# EAGLE design 8.1 (EAGLE 9.2.0)

## Sheet 1 of 6: Microcontroller
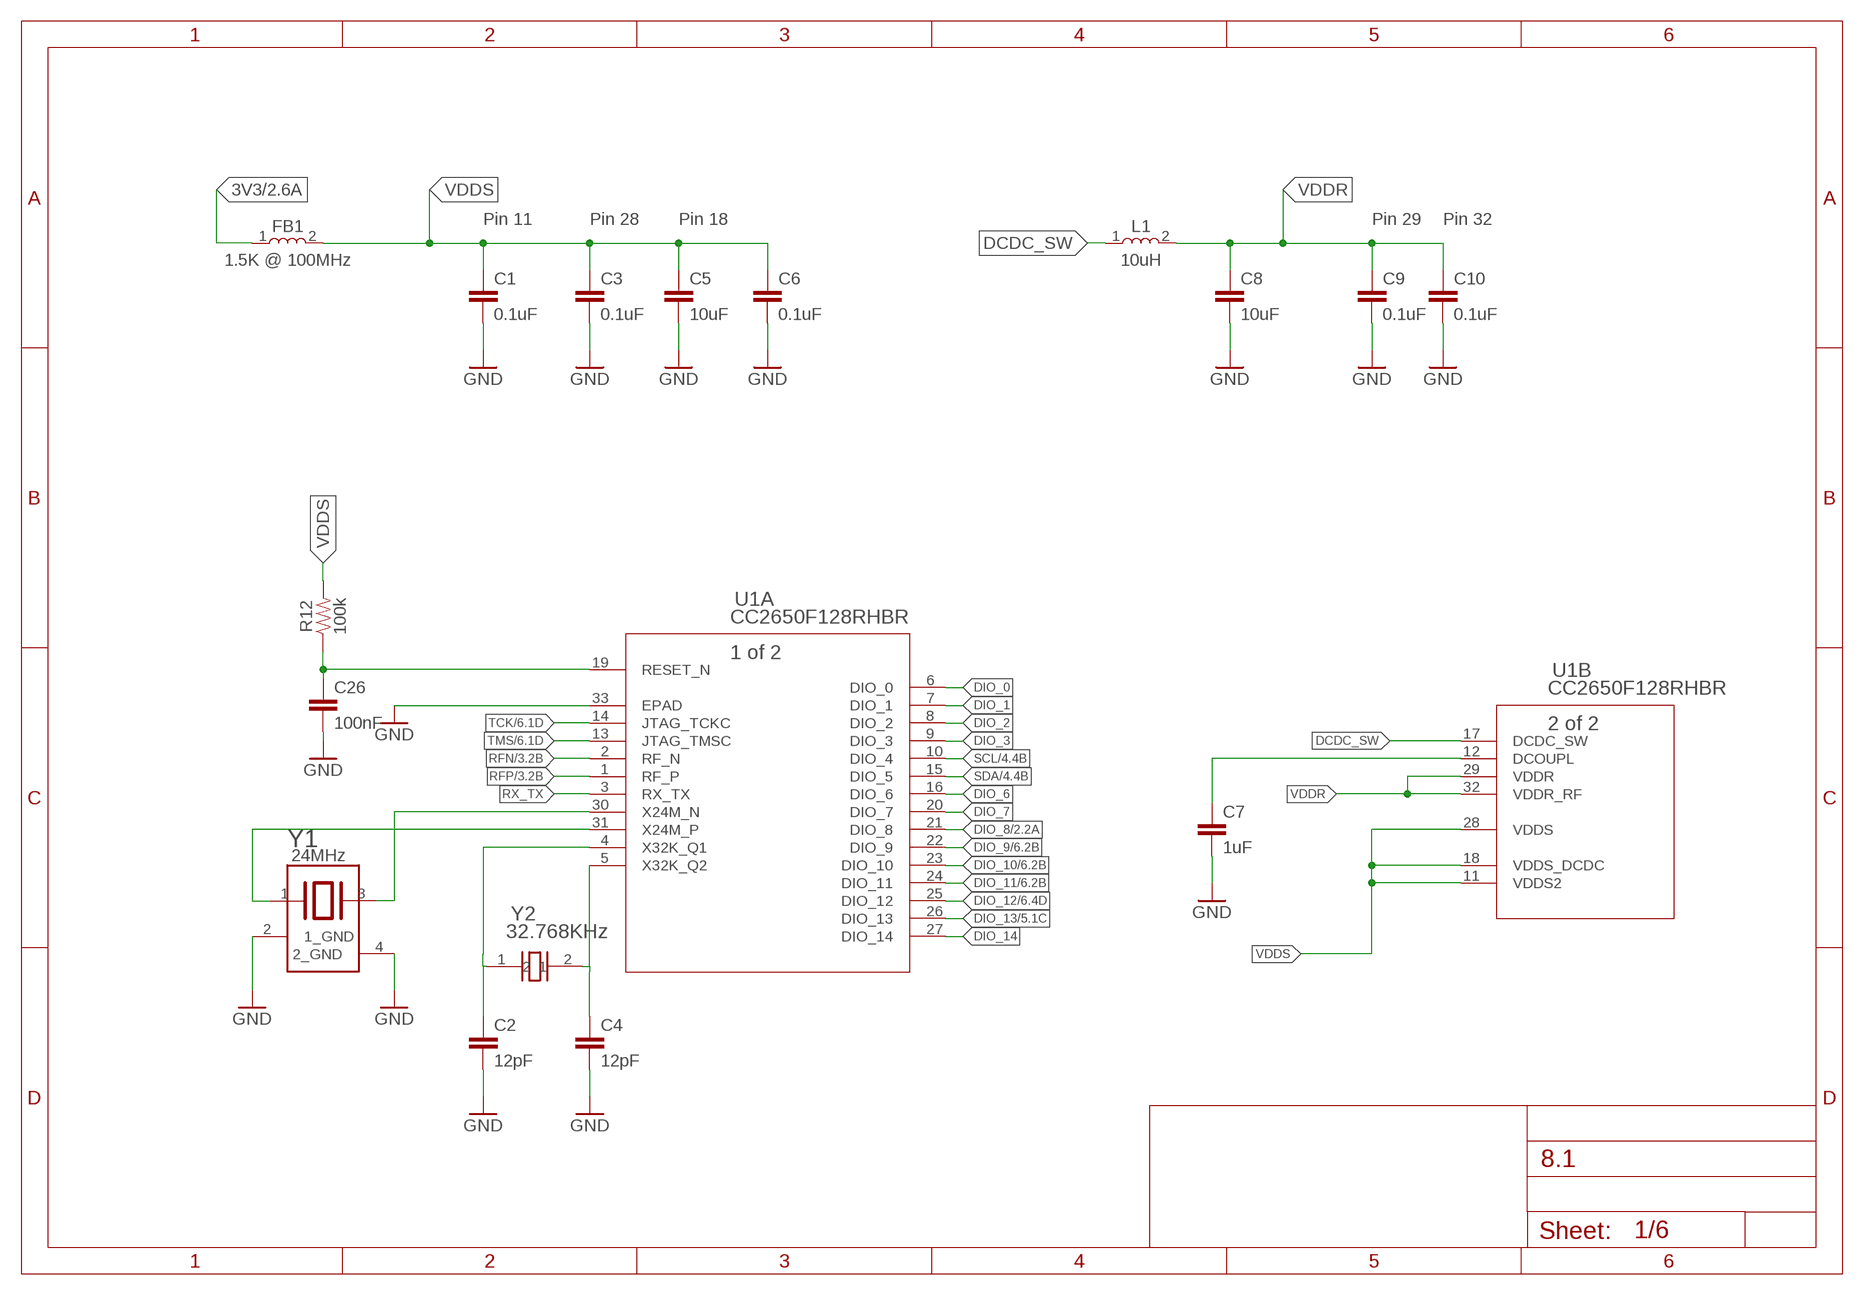
[diagram p0: schematic, sheet 1]

### Parts
C1  0.1uF  C0402  [0402]
C2  12pF  C0402_5%  [0402]
C3  0.1uF  C0402  [0402]
C4  12pF  C0402_5%  [0402]
C5  10uF  C0402  [0402]
C6  0.1uF  C0402  [0402]
C7  1uF  C0402  [0402]
C8  10uF  C0402  [0402]
C9  0.1uF  C0402  [0402]
C10  0.1uF  C0402  [0402]
C26  100nF  C0402_5%  [0402]
FB1  1.5K @ 100MHz  FERRITE_BEAD_CC2650  [0603]
L1  10uH  L0805  [0805]
R12  100k  R0402  [0402]
U1  CC2650F128RHBR  [VFQFN-32]
Y1  24MHz  XTAL_24MHZ_CC2650_HF  [TSX-3225]
Y2  32.768KHz  XTAL_32.768KHZ_CC2650_LF  [FC-135]

### Nets
3V3: FB1.1 ; also sheet 2,4,5,6
DCDC_SW: L1.1 U1.17(B:DCDC_SW)
DIO_0: U1.6(A:DIO_0)
DIO_1: U1.7(A:DIO_1)
DIO_2: U1.8(A:DIO_2)
DIO_3: U1.9(A:DIO_3)
DIO_6: U1.16(A:DIO_6)
DIO_7: U1.20(A:DIO_7)
DIO_8: U1.21(A:DIO_8) ; also sheet 2
DIO_9: U1.22(A:DIO_9) ; also sheet 6
DIO_10: U1.23(A:DIO_10) ; also sheet 6
DIO_11: U1.24(A:DIO_11) ; also sheet 6
DIO_12: U1.25(A:DIO_12) ; also sheet 6
DIO_13: U1.26(A:DIO_13) ; also sheet 5
DIO_14: U1.27(A:DIO_14)
GND: C1.2 C2.2 C3.2 C4.2 C5.2 C6.2 C7.2 C8.2 C9.2 C10.2 C26.2 U1.33(A:EPAD) Y1.2(1_GND) Y1.4(2_GND) ; also sheet 2,3,4,5,6
N$2: C7.1 U1.12(B:DCOUPL)
N$4: U1.30(A:X24M_N) Y1.3
N$5: U1.31(A:X24M_P) Y1.1
N$6: C2.1 U1.4(A:X32K_Q1) Y2.1
N$7: C4.1 U1.5(A:X32K_Q2) Y2.2
N$15: C26.1 R12.1 U1.19(A:RESET_N)
RFN: U1.2(A:RF_N) ; also sheet 3
RFP: U1.1(A:RF_P) ; also sheet 3
RX_TX: U1.3(A:RX_TX)
SCL: U1.10(A:DIO_4) ; also sheet 4,6
SDA: U1.15(A:DIO_5) ; also sheet 4,6
TCK: U1.14(A:JTAG_TCKC) ; also sheet 6
TMS: U1.13(A:JTAG_TMSC) ; also sheet 6
VDDR: C8.1 C9.1 C10.1 L1.2 U1.29(B:VDDR) U1.32(B:VDDR_RF)
VDDS: C1.1 C3.1 C5.1 C6.1 FB1.2 R12.2 U1.11(B:VDDS2) U1.18(B:VDDS_DCDC) U1.28(B:VDDS)

### Notes on the sheet
- Pin 11 | Pin 28 | Pin 18 | Pin 29 | Pin 32

## Sheet 2 of 6: Power Management
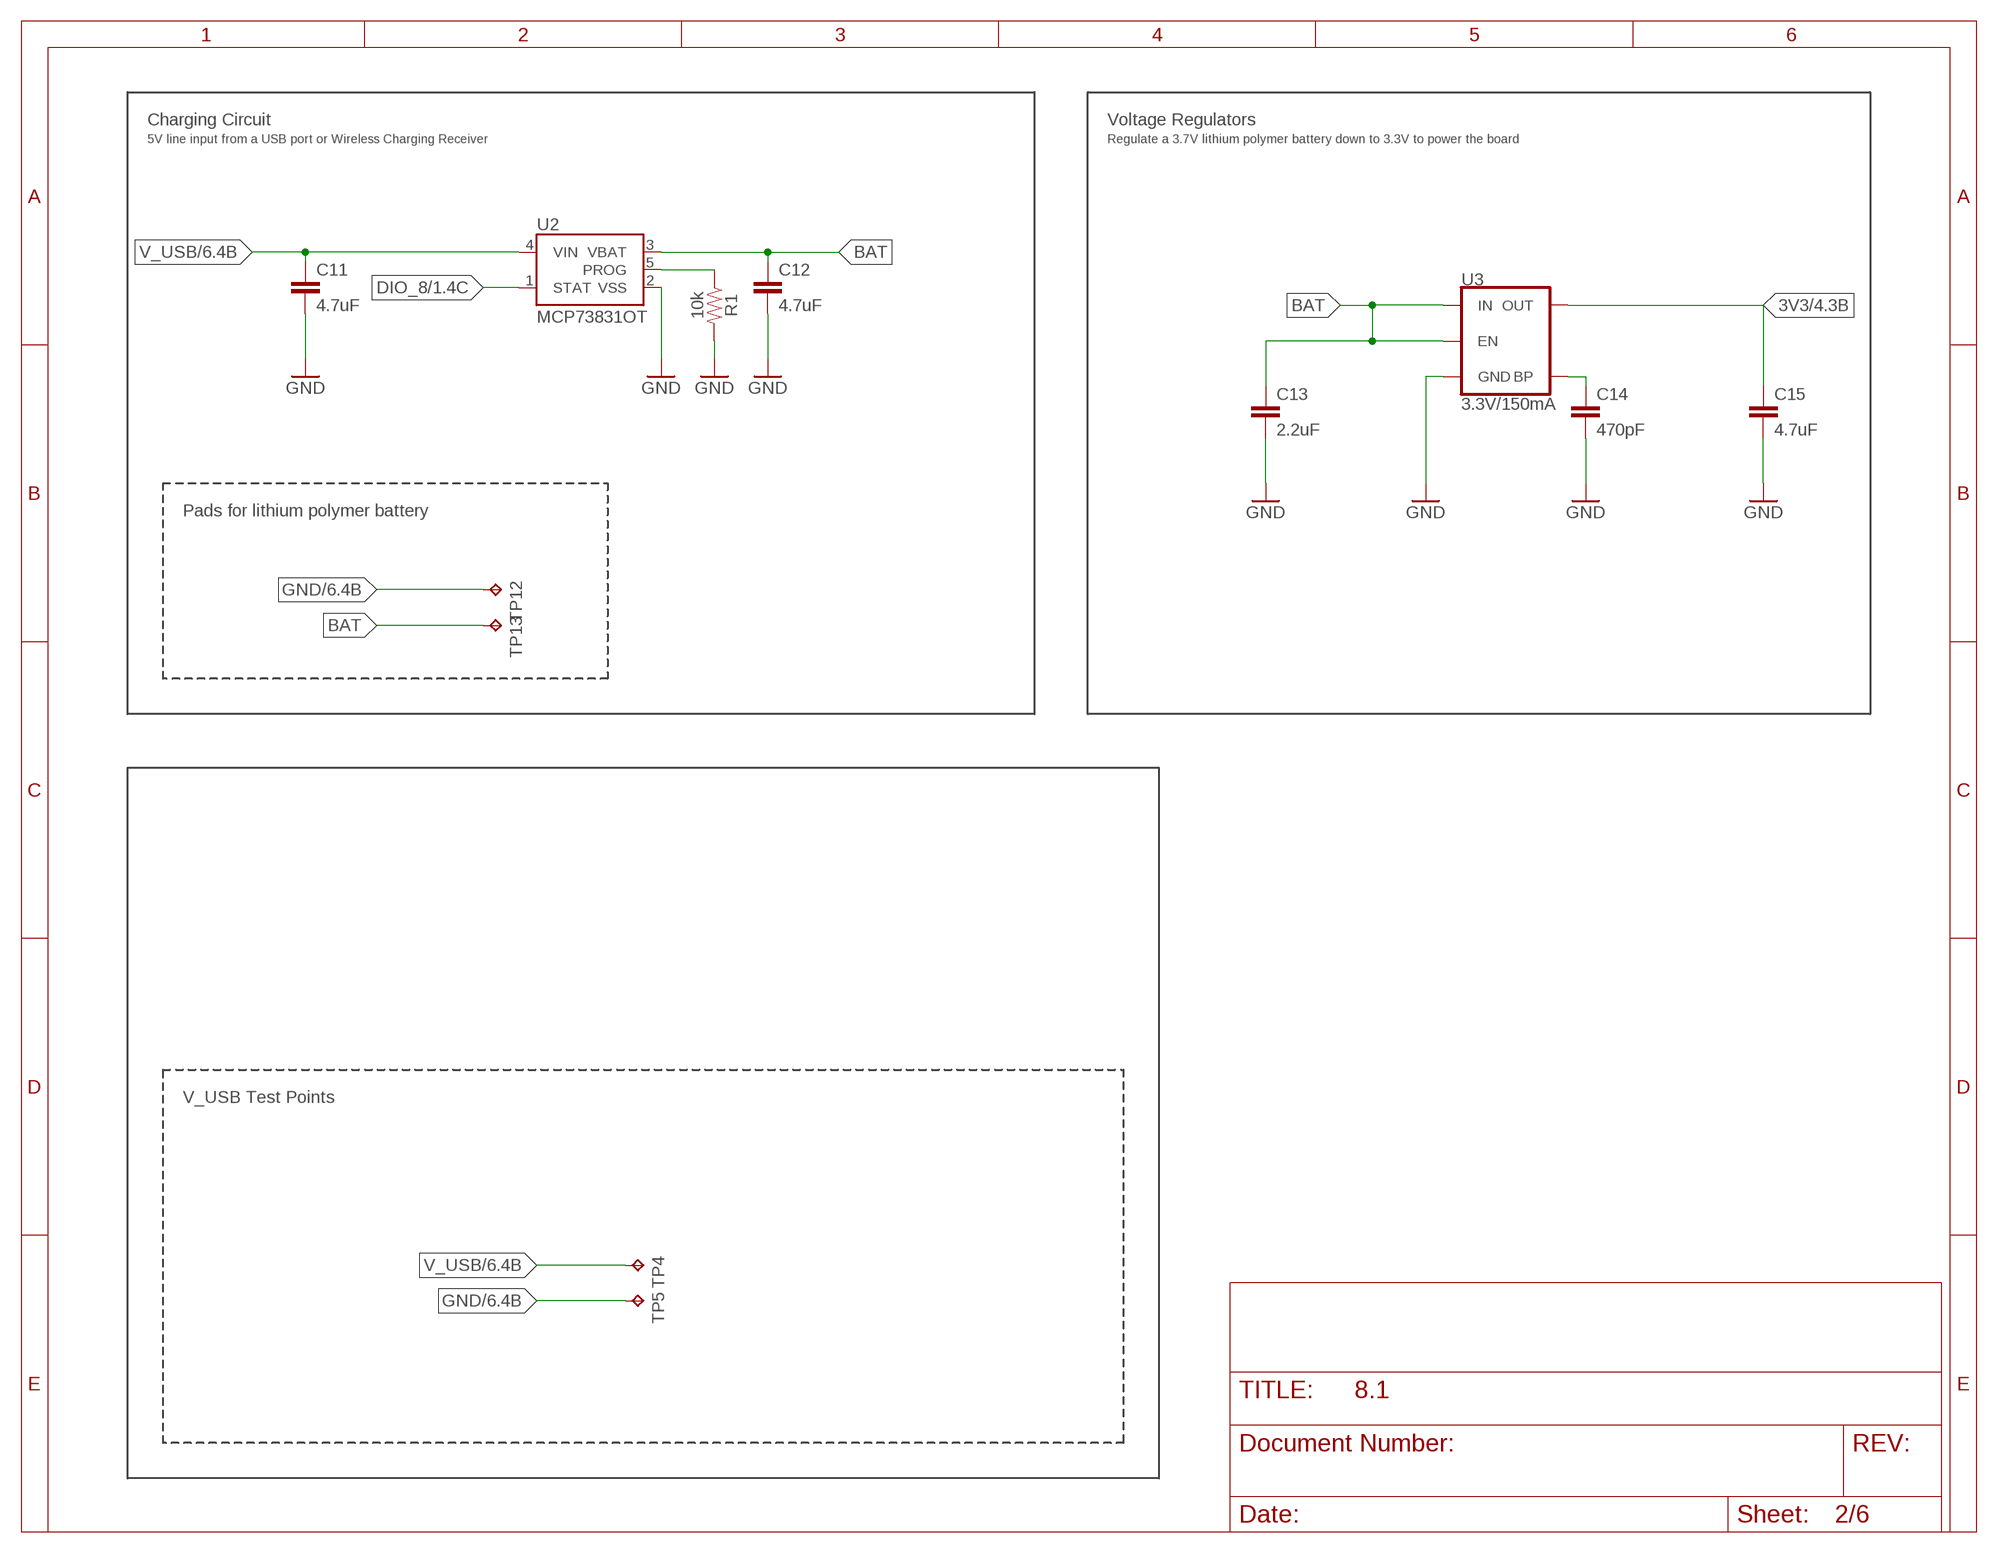
[diagram p1: schematic, sheet 2]

### Parts
C11  4.7uF  C0402  [0402]
C12  4.7uF  C0402  [0402]
C13  2.2uF  C0402  [0402]
C14  470pF  C0402  [0402]
C15  4.7uF  C0402_TANT  [0402]
R1  10k  R0402  [0402]
TP4  TESTPADBOTH  [TESTPAD_1.27_BOTH_SIDE]
TP5  TESTPADBOTH  [TESTPAD_1.27_BOTH_SIDE]
TP12  TESTPAD  [WIREPAD_1.27_2.54]
TP13  TESTPAD  [WIREPAD_1.27_2.54]
U2  MCP73831OT  [SOT23-5]
U3  3.3V/150mA  MIC52053.3V  [SOT23-5]

### Nets
3V3: C15.1 U3.5(OUT) ; also sheet 1,4,5,6
BAT: C12.1 C13.1 TP13.1(TP) U2.3(VBAT) U3.1(IN) U3.3(EN)
DIO_8: U2.1(STAT) ; also sheet 1
GND: C11.2 C12.2 C13.2 C14.2 C15.2 R1.2 TP5.P$1(TP) TP5.TP TP5.TP1(TP) TP12.1(TP) U2.2(VSS) U3.2(GND) ; also sheet 1,3,4,5,6
N$21: R1.1 U2.5(PROG)
N$27: C14.1 U3.4(BP)
V_USB: C11.1 TP4.P$1(TP) TP4.TP TP4.TP1(TP) U2.4(VIN) ; also sheet 6

### Notes on the sheet
- Charging Circuit | Voltage Regulators
- 5V line input from a USB port or Wireless Charging Receiver | Regulate a 3.7V lithium polymer battery down to 3.3V to power the board
- Pads for lithium polymer battery
- V_USB Test Points

## Sheet 3 of 6: RF Circuit
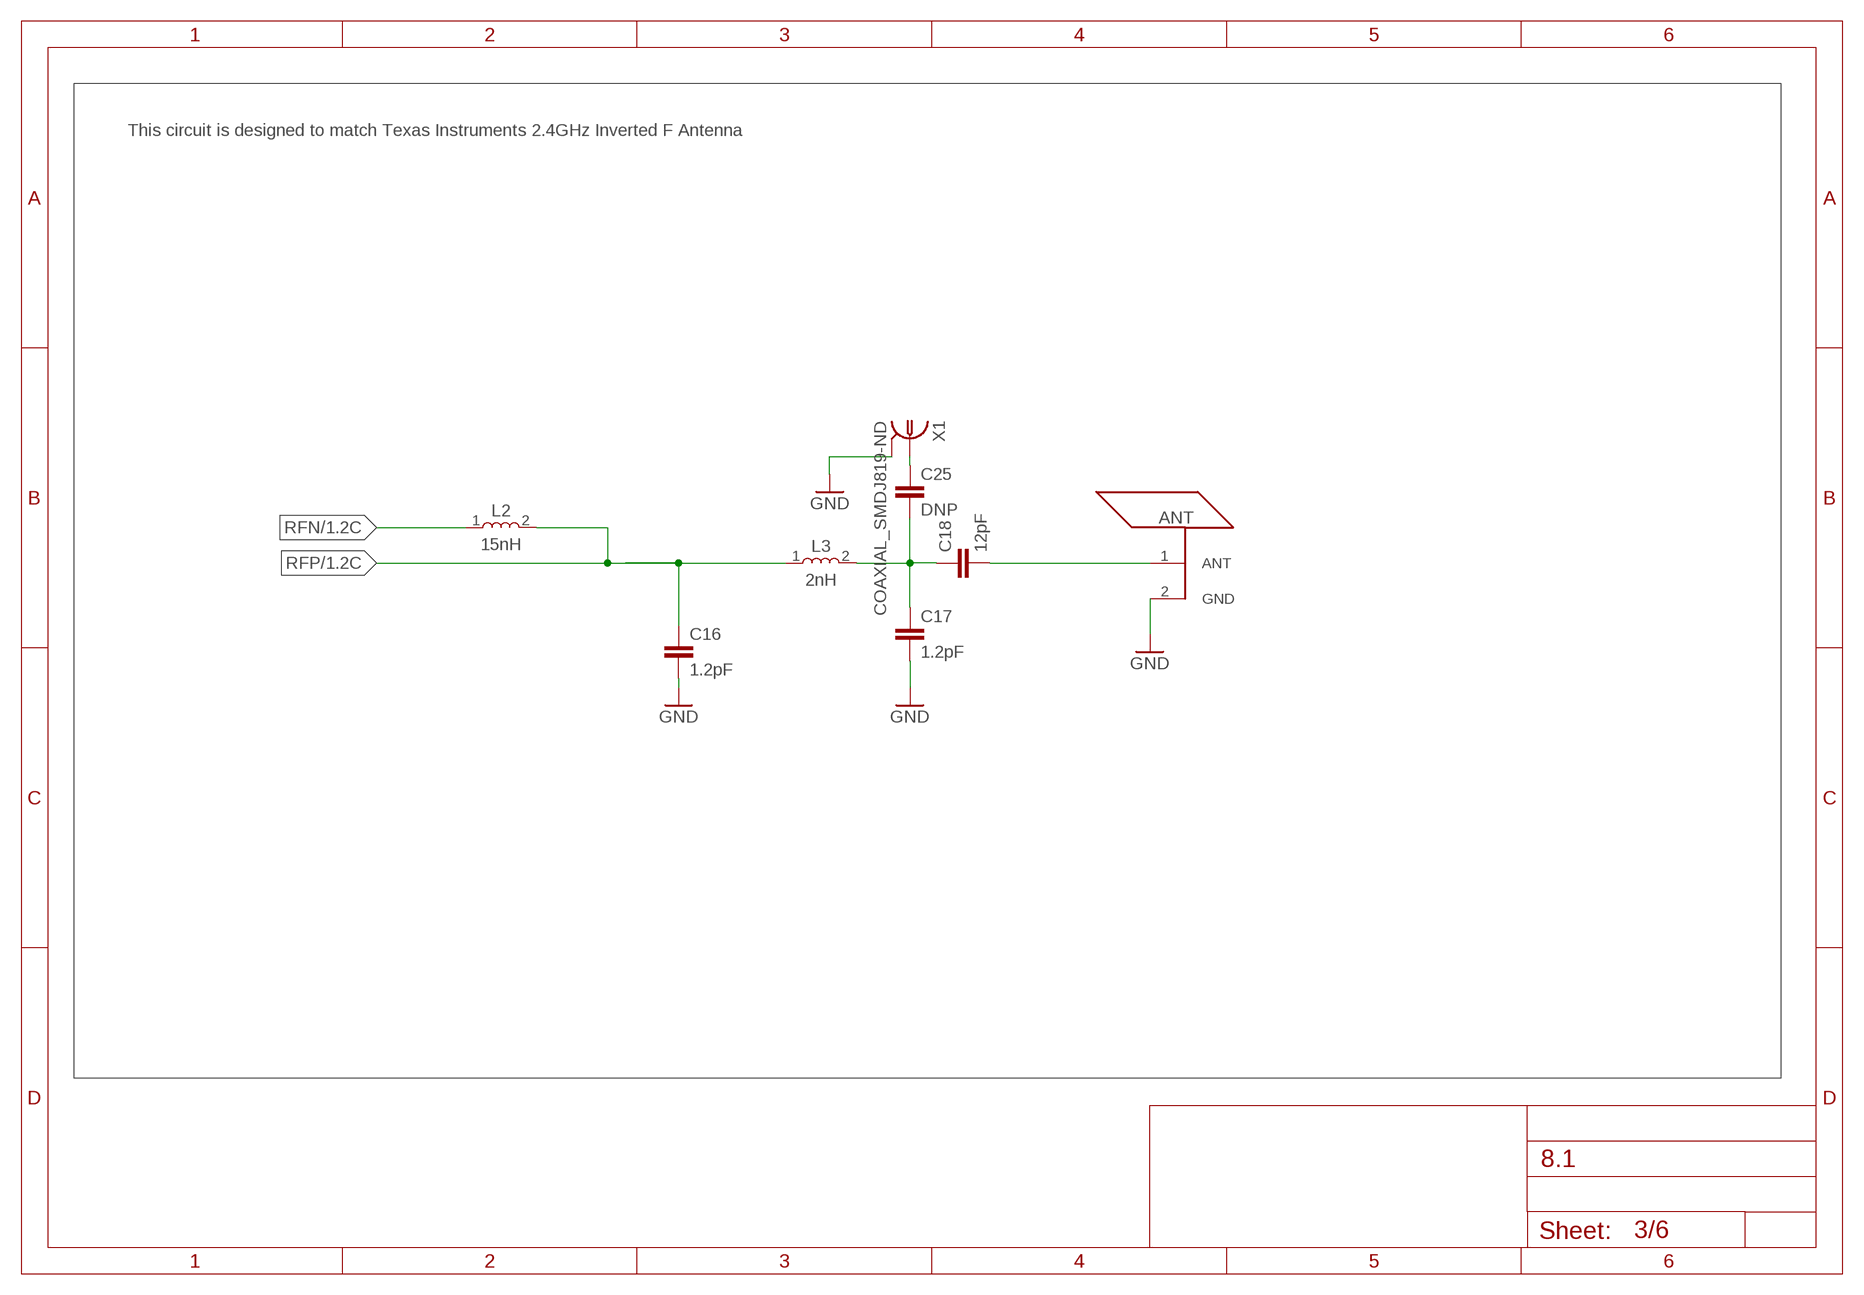
[diagram p2: schematic, sheet 3]

### Parts
ANT  ANT  [AN043_ANT_TRACE]
C16  1.2pF  C0402_0.1PF  [0402]
C17  1.2pF  C0402_0.1PF  [0402]
C18  12pF  C0402_5%  [0402]
C25  DNP  C0402  [0402]
L2  15nH  L0402_0.3NH  [0402]
L3  2nH  L0402_0.3NH  [0402]
X1  COAXIAL_SMDJ819-ND  [COAXIAL_SMD]

### Nets
GND: ANT.2(GND) C16.2 C17.2 X1.2@1 X1.2@2 X1.2@3 X1.2@4 X1.2@5 X1.2@6 ; also sheet 1,2,4,5,6
N$1: C17.1 C18.1 C25.2 L3.2
N$3: ANT.1(ANT) C18.2
N$14: C25.1 X1.1
RFN: L2.1 ; also sheet 1
RFP: C16.1 L2.2 L3.1 ; also sheet 1

### Notes on the sheet
- This circuit is designed to match Texas Instruments 2.4GHz Inverted F Antenna

## Sheet 4 of 6: IMU
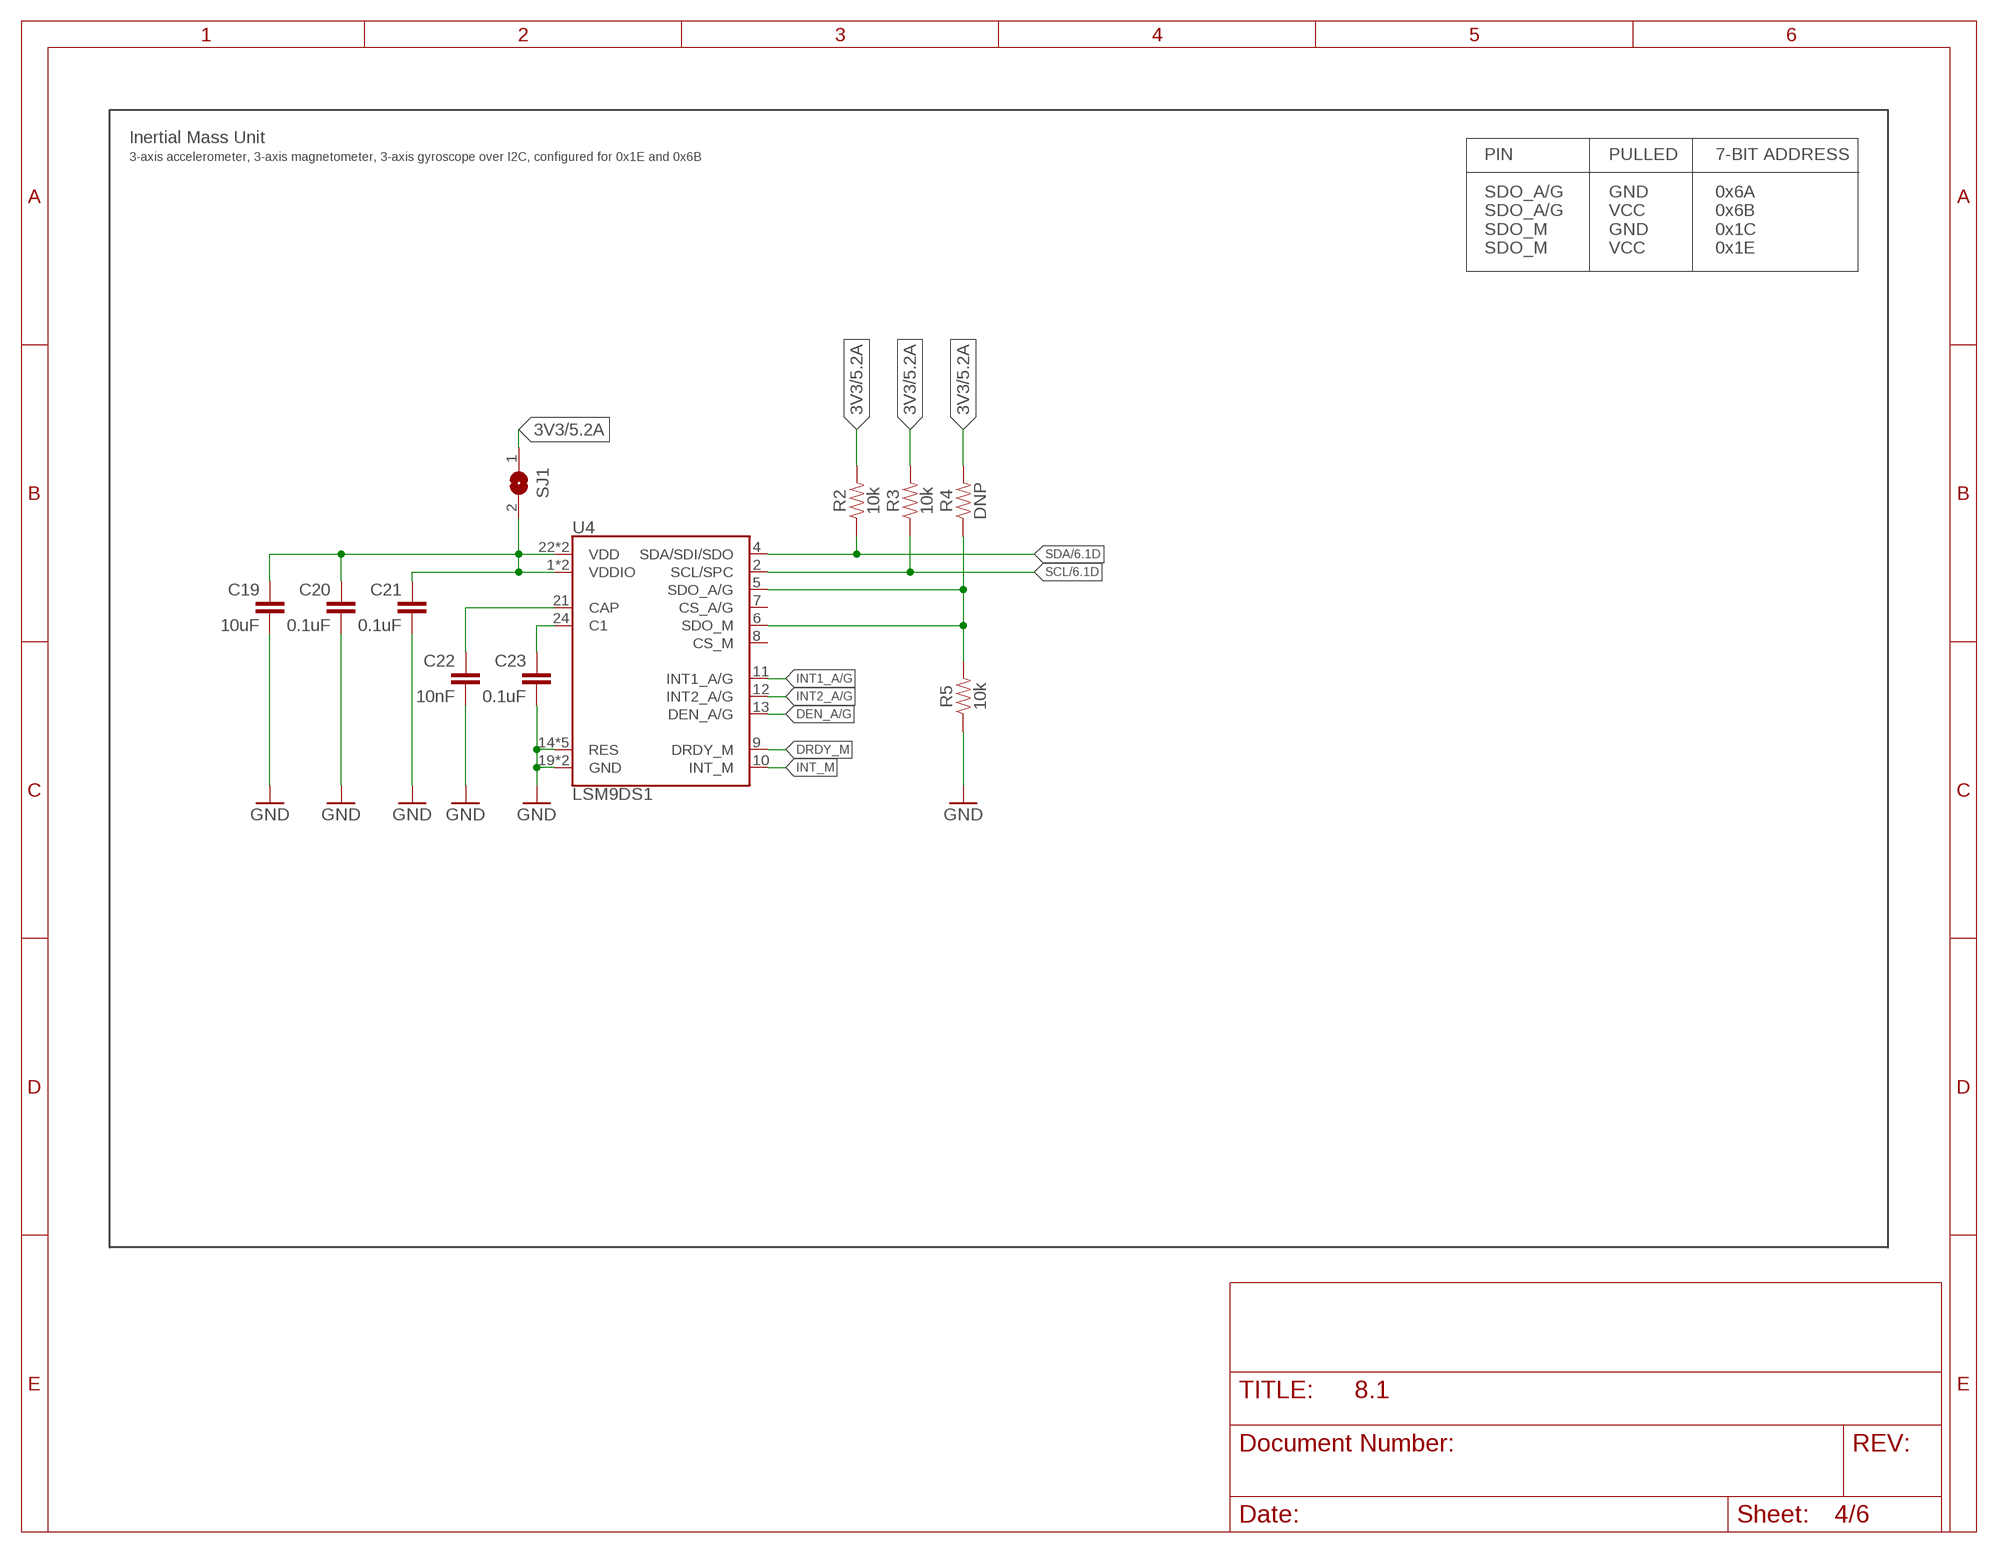
[diagram p3: schematic, sheet 4]

### Parts
C19  10uF  C0402  [0402]
C20  0.1uF  C0402  [0402]
C21  0.1uF  C0402  [0402]
C22  10nF  C0402  [0402]
C23  0.1uF  C0402  [0402]
R2  10k  R0402  [0402]
R3  10k  R0402  [0402]
R4  DNP  R0402  [0402]
R5  10k  R0402  [0402]
SJ1  SOLDER_JUMPER  [SOLDER_JUMPER]
U4  LSM9DS1  [LGA-24]

### Nets
3V3: R2.2 R3.2 R4.2 SJ1.1 ; also sheet 1,2,5,6
C1: C23.1 U4.24(C1)
CAP: C22.1 U4.21(CAP)
DEN_A/G: U4.13(DEN_A/G)
DRDY_M: U4.9(DRDY_M)
GND: C19.2 C20.2 C21.2 C22.2 C23.2 R5.1 U4.14(RES) U4.15(RES) U4.16(RES) U4.17(RES) U4.18(RES) U4.19(GND) U4.20(GND) ; also sheet 1,2,3,5,6
IMU_VDD: C19.1 C20.1 C21.1 SJ1.2 U4.1(VDDIO) U4.3(VDDIO) U4.22(VDD) U4.23(VDD)
INT1_A/G: U4.11(INT1_A/G)
INT2_A/G: U4.12(INT2_A/G)
INT_M: U4.10(INT_M)
SCL: R3.1 U4.2(SCL/SPC) ; also sheet 1,6
SDA: R2.1 U4.4(SDA/SDI/SDO) ; also sheet 1,6
SDO: R4.1 R5.2 U4.5(SDO_A/G) U4.6(SDO_M)
Unconnected: U4.7(CS_A/G) U4.8(CS_M)

### Notes on the sheet
- Inertial Mass Unit
- 3-axis accelerometer, 3-axis magnetometer, 3-axis gyroscope over I2C, configured for 0x1E and 0x6B
- PIN
  
  SDO_A/G
  SDO_A/G
  SDO_M
  SDO_M
- PULLED
  
  GND
  VCC
  GND
  VCC
- 7-BIT ADDRESS
  
  0x6A
  0x6B
  0x1C
  0x1E

## Sheet 5 of 6: Vibration Motor
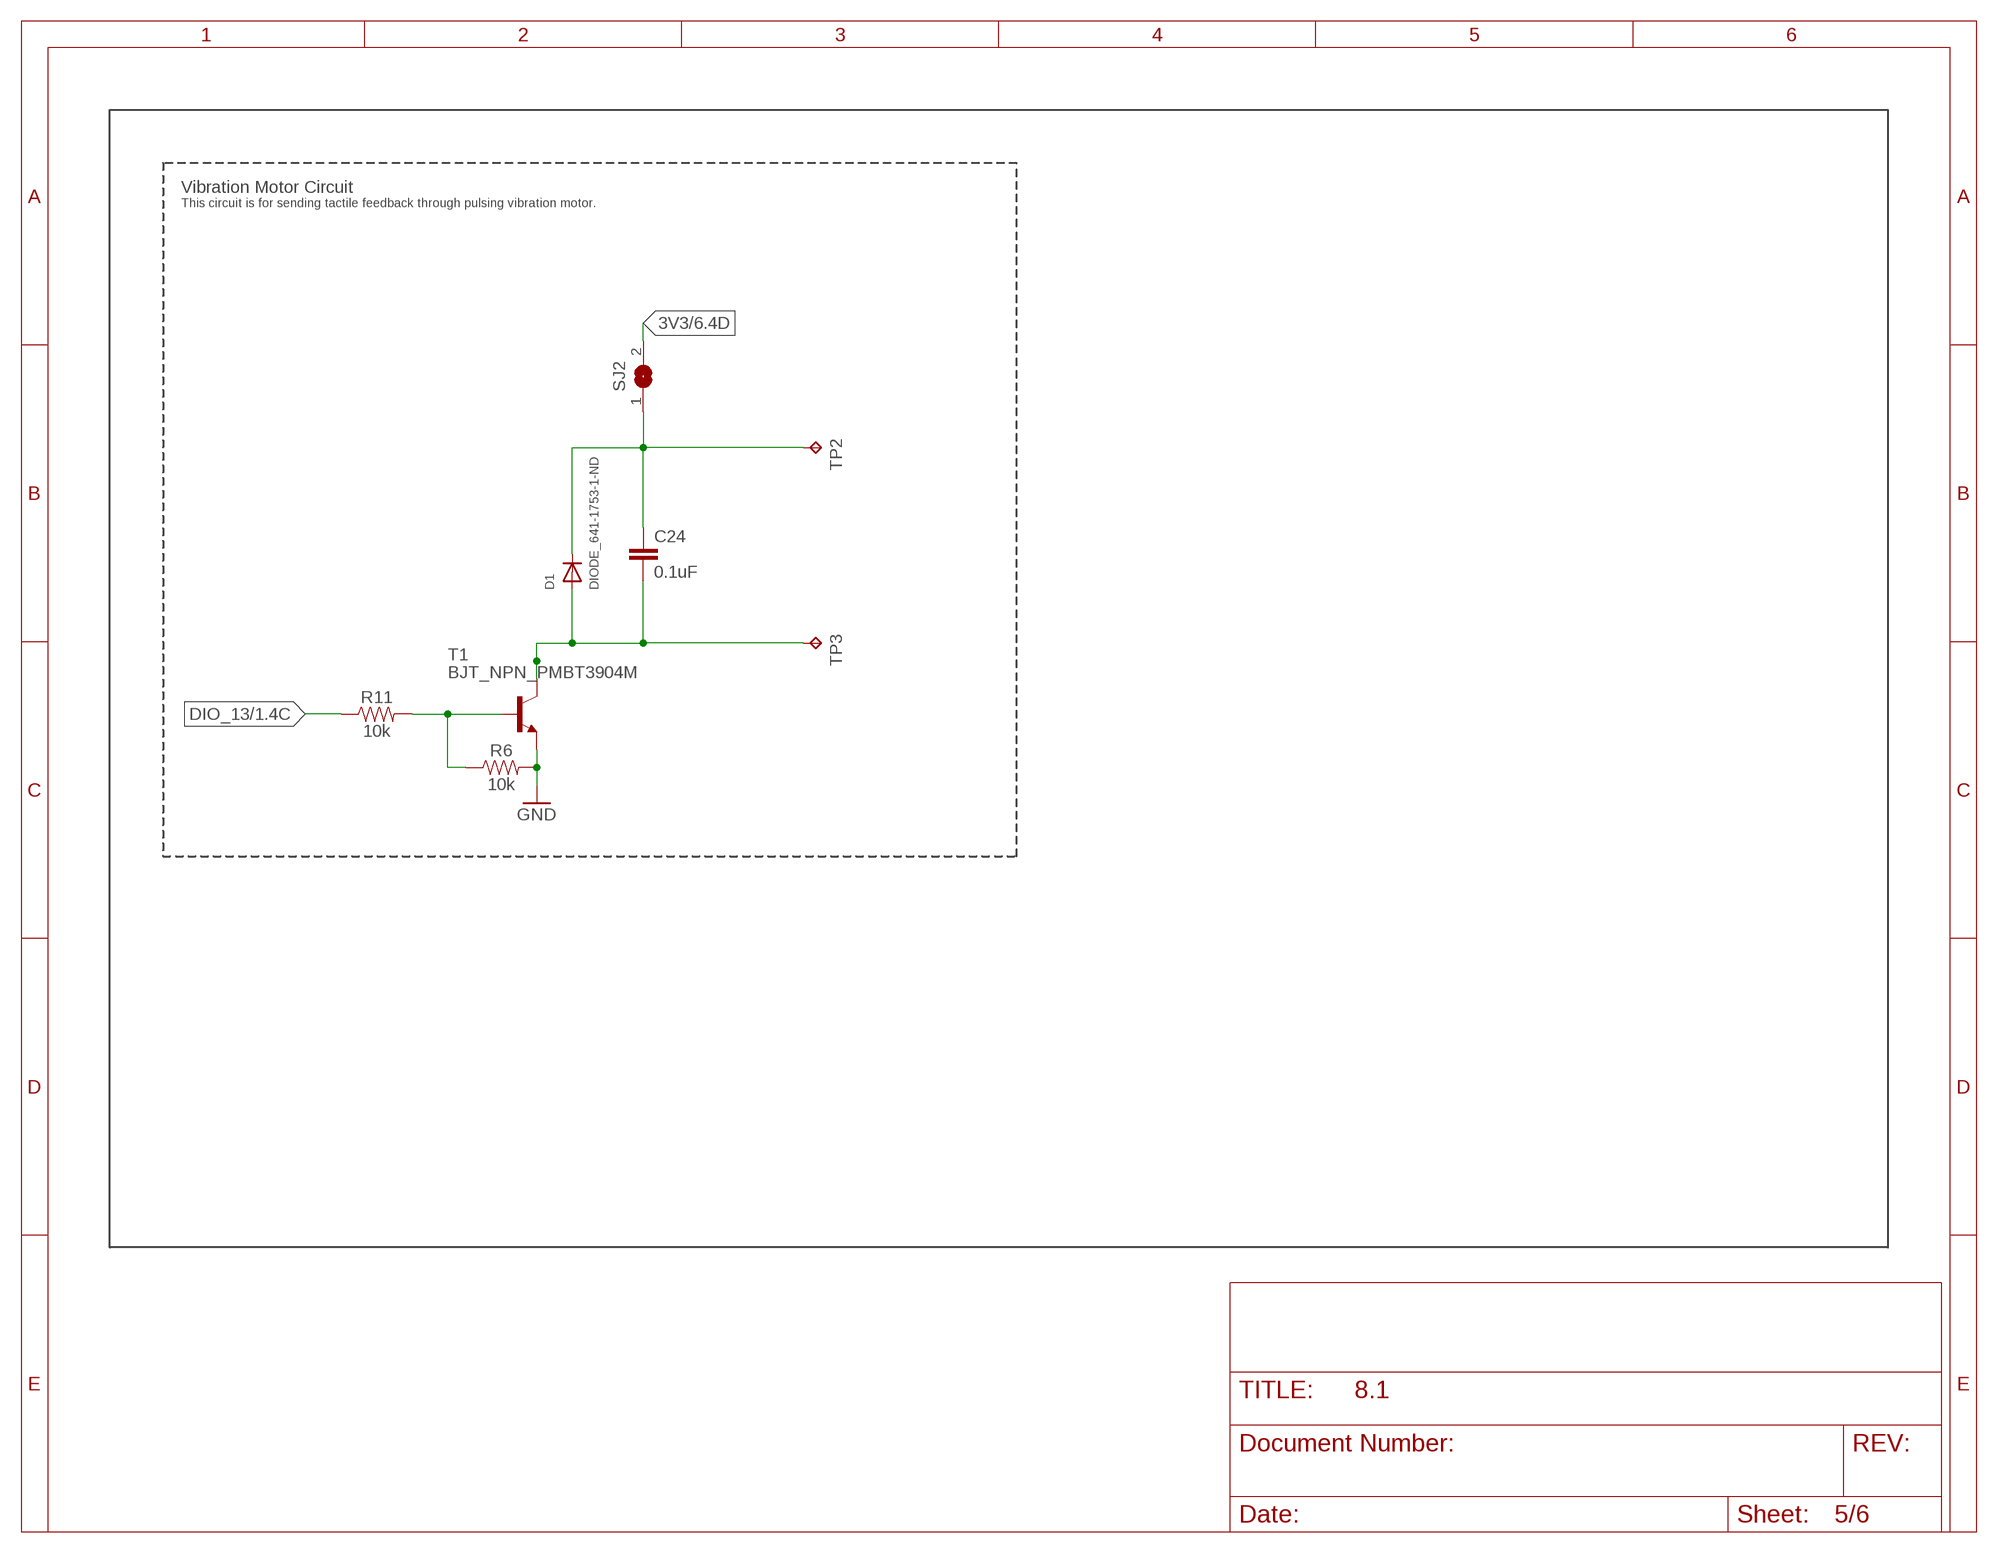
[diagram p4: schematic, sheet 5]

### Parts
C24  0.1uF  C0402  [0402]
D1  DIODE_641-1753-1-ND  [SOD-923F]
R6  10k  R0402  [0402]
R11  10k  R0402  [0402]
SJ2  SOLDER_JUMPER  [SOLDER_JUMPER]
T1  BJT_NPN_PMBT3904M  [SOT-883]
TP2  TESTPADBOTH  [TESTPAD_1.27_BOTH_SIDE]
TP3  TESTPADBOTH  [TESTPAD_1.27_BOTH_SIDE]

### Nets
3V3: SJ2.2 ; also sheet 1,2,4,6
DIO_13: R11.1 ; also sheet 1
GND: R6.2 T1.2(E) ; also sheet 1,2,3,4,6
MOTOR_VDD: C24.1 D1.C SJ2.1 TP2.P$1(TP) TP2.TP TP2.TP1(TP)
N$12: C24.2 D1.A T1.3(C) TP3.P$1(TP) TP3.TP TP3.TP1(TP)
N$13: R6.1 R11.2 T1.1(B)

### Notes on the sheet
- Vibration Motor Circuit
- This circuit is for sending tactile feedback through pulsing vibration motor.

## Sheet 6 of 6: Status LED
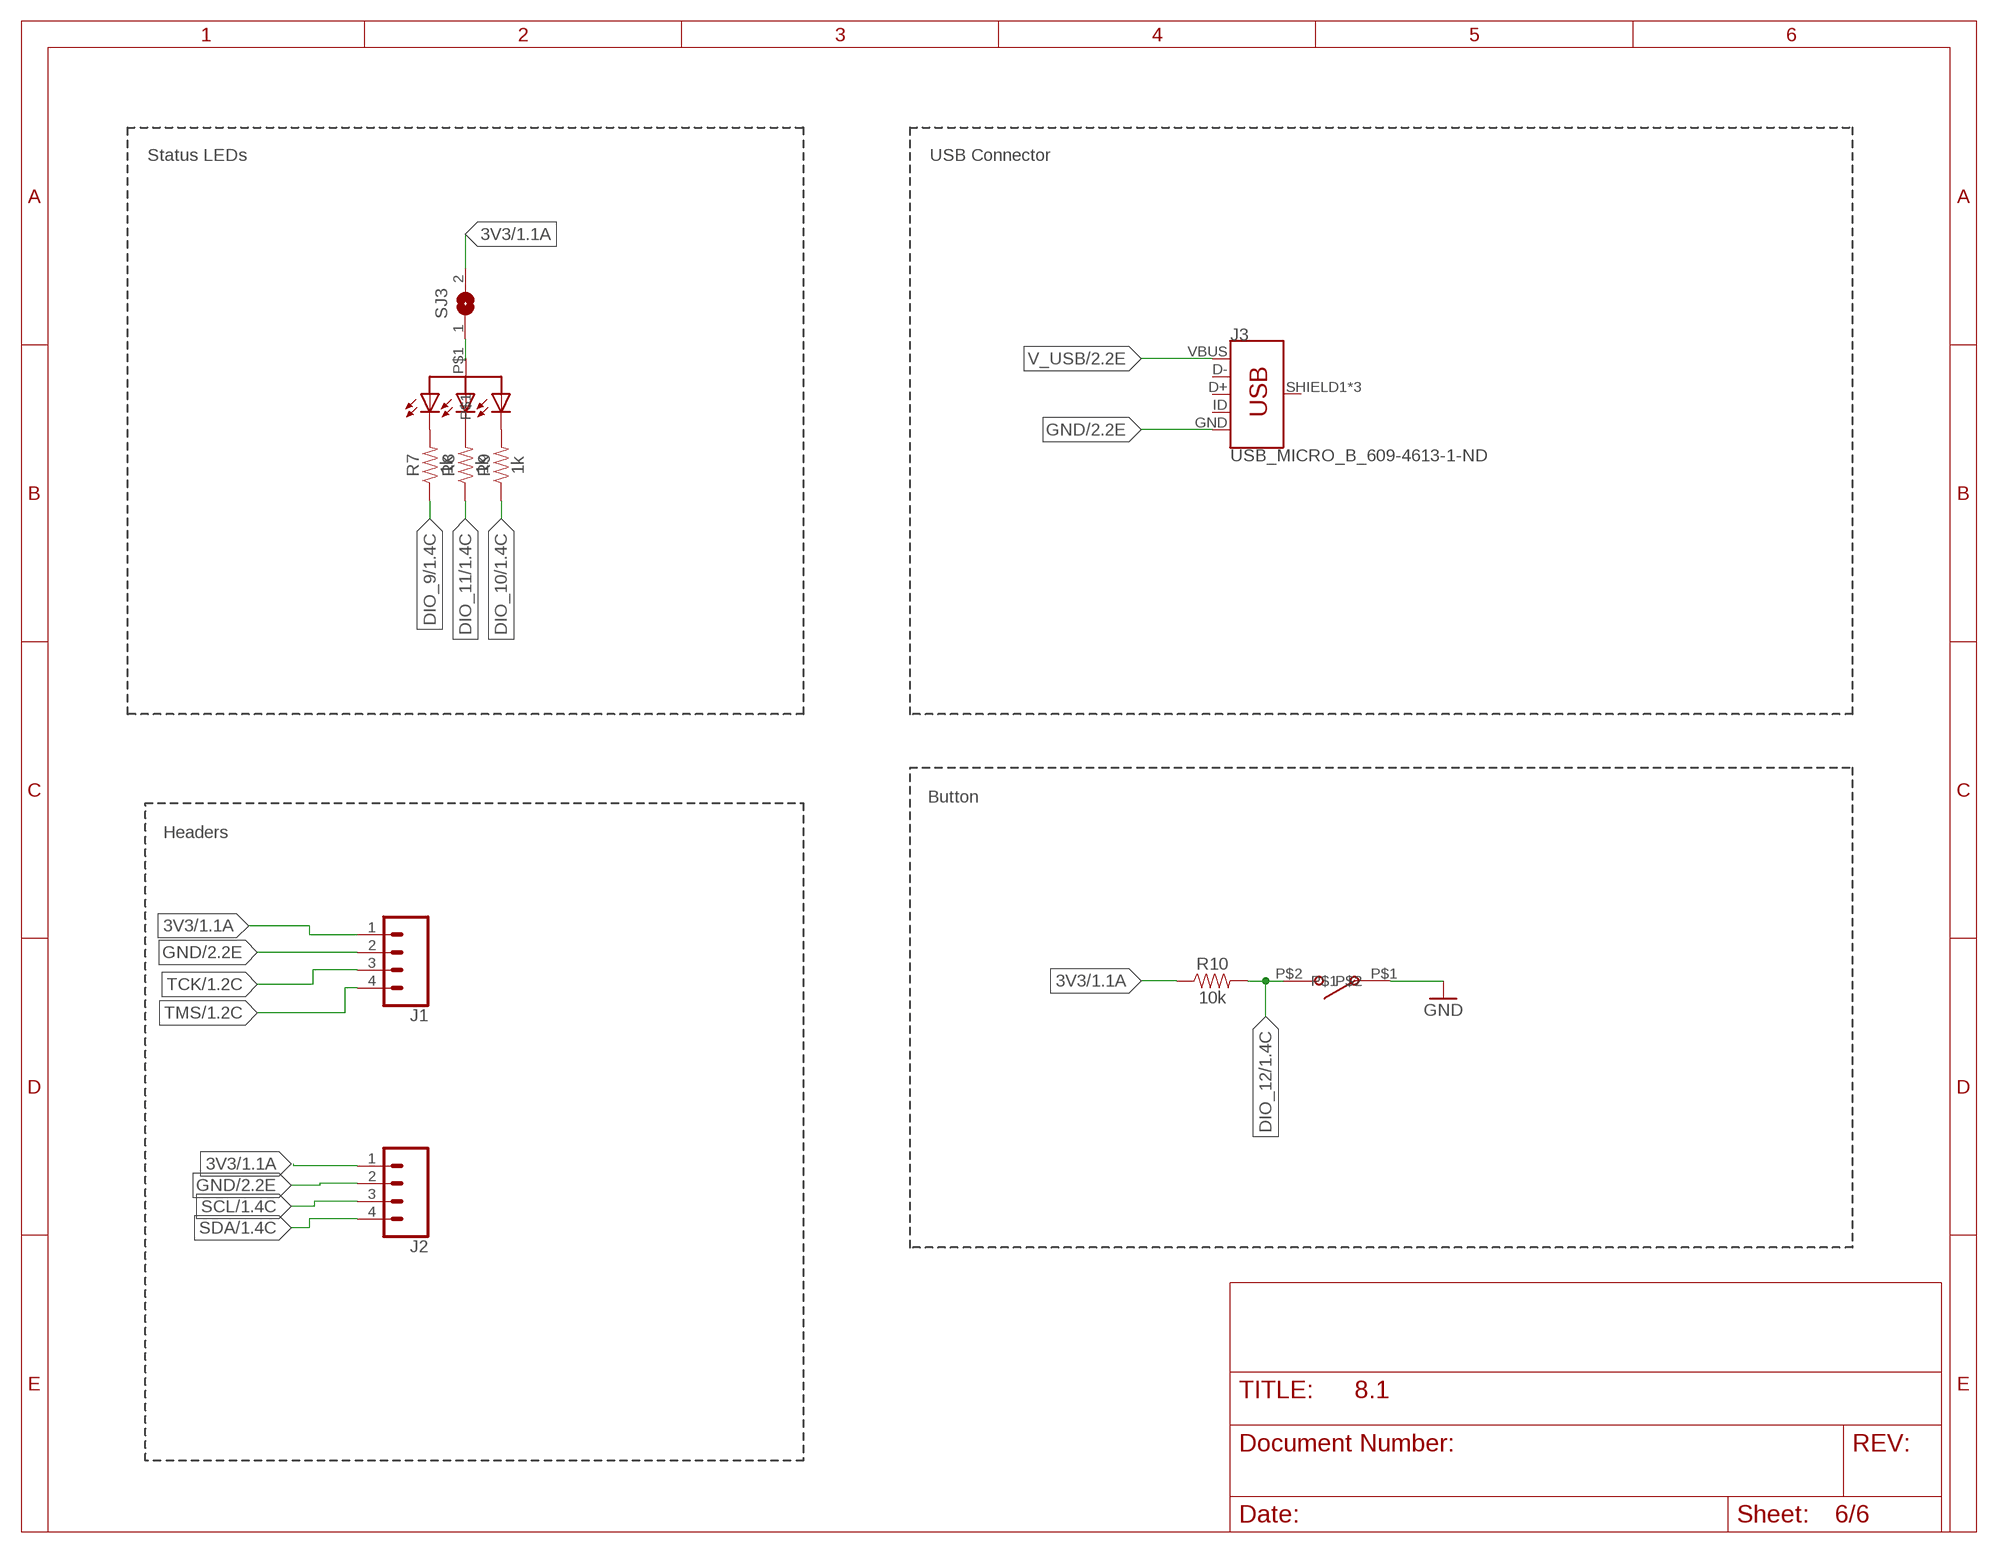
[diagram p5: schematic, sheet 6]

### Parts
J1  CONN_04  [1X04]
J2  CONN_04  [1X04]
J3  USB_MICRO_B_609-4613-1-ND  [USB_MICRO_B]
LED1  LED_TRICOLOR_3.2X2.8  [LED_3.2X2.8]
R7  1k  R0402  [0402]
R8  1k  R0402  [0402]
R9  1k  R0402  [0402]
R10  10k  R0402  [0402]
SJ3  SOLDER_JUMPER  [SOLDER_JUMPER]
SW1  TACTILE_SWITCHES_CKN10839CT-ND  [PTS820_J25M]

### Nets
3V3: J1.1 J2.1 R10.1 SJ3.2 ; also sheet 1,2,4,5
DIO_9: R7.1 ; also sheet 1
DIO_10: R9.1 ; also sheet 1
DIO_11: R8.1 ; also sheet 1
DIO_12: R10.2 SW1.P$2 ; also sheet 1
GND: J1.2 J2.2 J3.GND SW1.P$1 ; also sheet 1,2,3,4,5
N$8: LED1.P$2 R7.2
N$9: LED1.P$3 R8.2
N$10: LED1.P$4 R9.2
N$11: LED1.P$1 SJ3.1
SCL: J2.3 ; also sheet 1,4
SDA: J2.4 ; also sheet 1,4
TCK: J1.3 ; also sheet 1
TMS: J1.4 ; also sheet 1
V_USB: J3.VBUS ; also sheet 2
Unconnected: J3.D+ J3.D- J3.ID J3.SHIELD1(SHIELD) J3.SHIELD2(SHIELD) J3.SHIELD3(SHIELD)

### Notes on the sheet
- Status LEDs | USB Connector
- Button
- Headers

## Library data of the parts
ANT = movit-passive:ANT
C1 C3 C5-C12 C19-C25 = movit-passive:C
C2 C4 C18 C26 = movit-passive:C; TOL: 5%
C13-C15 = movit-passive:C; MPN: 0603YC104K4Z2A; OC_NEWARK: 26M5119
C16 C17 = movit-passive:C; TOL: 0.1pF
D1 = movit-passive:DIODE; DIGIKEY: 641-1753-1-ND
FB1 = movit-passive:FERRITE_BEAD; DIGIKEY: 490-5216-1-ND
J1 J2 = SparkFun-Connectors:CONN_04: Multi connection point. Often used as Generic Header-pin footprint for 0.1 inch spaced/style header connections On any of the 0.1 inch spaced packages, you can populate with these: Break Away Headers - Straight <https://www.sparkfun.com/products/116> (PRT-00116) Break Away Male Headers - Right Angle <https://www.sparkfun.com/products/553> (PRT-00553) Female Headers <https://www.sparkfun.com/products/115> (PRT-00115) Break Away Headers - Machine Pin <https://www.sparkfun.com/products/117> (PRT-00117) Break Away Female Headers - Swiss Machine Pin <https://www.sparkfun.com/products/743> (PRT-00743) For SCREWTERMINALS and SPRING TERMINALS visit here: Screw Terimnals on SparkFun.com <https://www.sparkfun.com/search/results?term=Screw+Terminals> (5mm/3.5mm/2.54mm spacing) This device is also useful as a general connection point to wire up your design to another part of your project. Our various solder wires solder well into these plated through hole pads. Hook-Up Wire - Assortment (Stranded, 22 AWG) <https://www.sparkfun.com/products/11375> (PRT-11375) Hook-Up Wire - Assortment (Solid Core, 22 AWG) <https://www.sparkfun.com/products/11367> (PRT-11367) View the entire wire category on our website here <https://www.sparkfun.com/categories/141> Special notes: Molex polarized connector foot print use with SKU : PRT-08231 with associated crimp pins and housings. 1MM SMD Version SKU: PRT-10208; PROD_ID: CONN-09696
J3 = movit-passive:USB_MICRO_B; DIGIKEY: 609-4613-1-ND
L1 = movit-passive:L
L2 L3 = movit-passive:L; TOL: 0.3nH
LED1 = movit-passive:LED_TRICOLOR; DIGIKEY: CLV1L-FKB-CHMMQEHBB7673673CT-ND
R1 R6-R11 = movit-passive:R
R2-R5 R12 = movit-passive:R; MF: BOURNS, INC.; MPN: CR0603-JW-103ELF; OC_NEWARK: 02J2286
SJ1-SJ3 = movit-passive:SOLDER_JUMPER
SW1 = movit-passive:TACTILE_SWITCHES; DIGIKEY: CKN10839CT-ND
T1 = movit-passive:BJT_NPN; DIGIKEY: 1727-6287-1-ND
TP2-TP5 TP12 TP13 = movit-passive:TESTPAD
U1 = movit:CC2650; DIGIKEY: 296-44317-1-ND
U2 = movit:MCP73831; DIGIKEY: MCP73831T-2ATI/OTCT-ND
U3 = movit:MIC5205; DIGIKEY: 576-1259-1-ND; MF: ALTERA CORPORATION; MPN: MIC5205-5.0YM5 TR; OC_NEWARK: 26K2313
U4 = movit:LSM9DS1; DIGIKEY: 497-14946-1-ND
X1 = movit-passive:COAXIAL_SMD; DIGIKEY: J819-ND
Y1 = movit-passive:XTAL_24MHZ; DIGIKEY: SER3635CT-ND
Y2 = movit-passive:XTAL_32.768KHZ; DIGIKEY: SER4089CT-ND

## Net classes
0 default: width 0.203 mm
1 VCC: width 0.356 mm

## Board
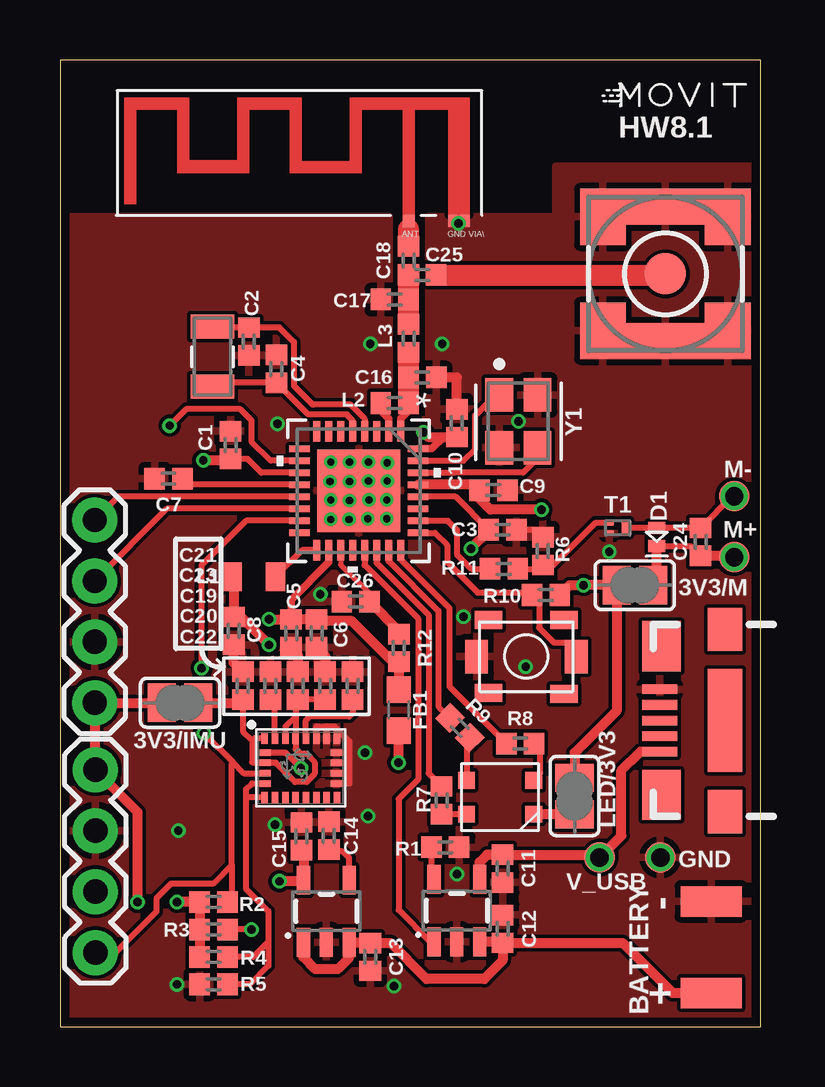
[diagram p6: board, top side]
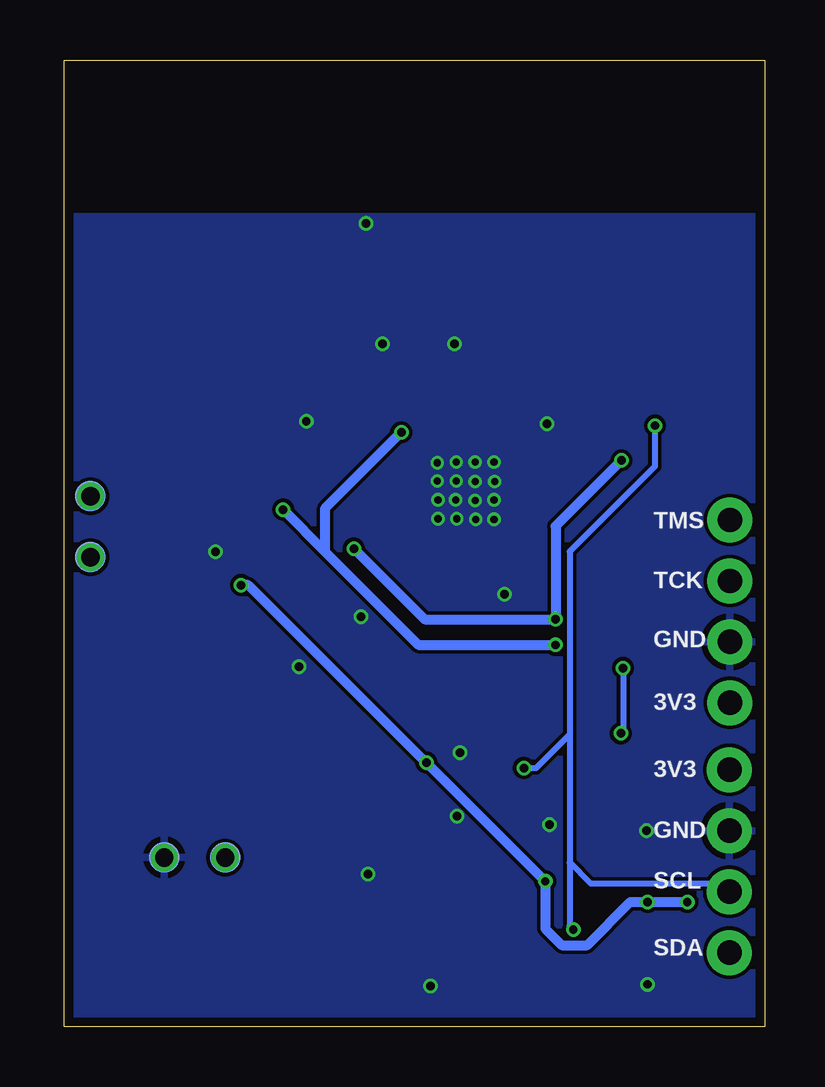
[diagram p7: board, bottom side, seen from below]

Size 29.19 x 40.31 mm. Coordinates in mm from the lower left corner, seen from the top.
Outline: 0,0 29.19,0 29.19,40.31 0,40.31 0,0
Copper layers (1*16): Top 0.035559375mm / dielectric 1.6mm / Bottom 0.035559375mm
Design rules "oshpark-2layer": minimum track width 6mil, minimum drill 10mil, track to track 6mil, track to pad 6mil, pad to pad 6mil, via to via 6mil, smd to smd 6mil, copper to edge 15mil, drill to drill 6mil, minimum pad ring 5mil, minimum via ring 5mil, stop-mask expansion 2.5mil, vias tented up to drill 0mil, thermal gap 10mil

### Footprints (pad centres in the part's own frame; a part is rotated, then mirrored left to right if it is on the bottom)
AN043_ANT_TRACE = smd 0.5 x 0.5: 1 12.19,-0.25 | smd 0.9 x 0.5: 2 14.29,-0.25
0402 = smd 0.85 x 0.9: 1 -0.58,0; 2 0.58,0
SOD-923F = smd 0.5 x 0.7: A -0.375,0; C 0.375,0
0603 = smd 1.1 x 1: 1 -0.85,0; 2 0.85,0
1X04 = drill 1.016 pad 1.88: 1 0,0; 2 2.54,0; 3 5.08,0; 4 7.62,0
USB_MICRO_B = smd 1.45 x 0.4: D+ 2.725,0; D- 2.725,0.65; GND 2.725,-1.3; ID 2.725,-0.65; VBUS 2.725,1.3 | smd 1.6 x 2.1: P$1 2.65,3.1; P$2 2.65,-3.1 | smd 1.45 x 1.8: SHIELD1 0,3.8; SHIELD2 0,-3.8 | smd 1.45 x 4.3: SHIELD3 0,0
0805 = smd 0.8 x 1.2: 1 -0.9,0; 2 0.9,0
LED_3.2X2.8 = smd 0.7 x 0.7: P$1 -1.4,0.7; P$2 1.4,0.7; P$3 -1.4,-0.7; P$4 1.4,-0.7
SOLDER_JUMPER = smd 1.168 x 1.6: 1 -0.762,0; 2 0.762,0
PTS820_J25M = smd 0.95 x 1.4: P$1 -2.075,0; P$2 2.075,0 | smd 1.15 x 0.75: P$3 -1.575,1.525; P$4 1.575,1.525; P$5 -1.575,-1.525; P$6 1.575,-1.55
SOT-883 = smd 0.4 x 0.25: 1 -0.35,0.225; 2 -0.35,-0.225 | smd 0.4 x 0.7: 3 0.35,0
TESTPAD_1.27_BOTH_SIDE = drill 0.762: P$1 0,0 | smd 1.27 x 1.27: TP 0,0 | smd 1.27 x 1.27 bottom: TP1 0,0
WIREPAD_1.27_2.54 = smd 1.27 x 2.54: 1 0,0
VFQFN-32 = smd 0.85 x 0.28: 1 -2.475,1.75; 2 -2.475,1.25; 3 -2.475,0.75; 4 -2.475,0.25; 5 -2.475,-0.25; 6 -2.475,-0.75; 7 -2.475,-1.25; 8 -2.475,-1.75; 17 2.475,-1.75; 18 2.475,-1.25; 19 2.475,-0.75; 20 2.475,-0.25; 21 2.475,0.25; 22 2.475,0.75; 23 2.475,1.25; 24 2.475,1.75 | smd 0.28 x 0.85: 9 -1.75,-2.475; 10 -1.25,-2.475; 11 -0.75,-2.475; 12 -0.25,-2.475; 13 0.25,-2.475; 14 0.75,-2.475; 15 1.25,-2.475; 16 1.75,-2.475; 25 1.75,2.475; 26 1.25,2.475; 27 0.75,2.475; 28 0.25,2.475; 29 -0.25,2.475; 30 -0.75,2.475; 31 -1.25,2.475; 32 -1.75,2.475 | smd 3.45 x 3.45: 33 0,0
SOT23-5 = smd 1.2 x 0.55: 1 -1.3,0.95; 2 -1.3,0; 3 -1.3,-0.95; 4 1.3,-0.95; 5 1.3,0.95
LGA-24 = smd 0.27 x 0.45: 1 -1.505,1.225; 6 -1.505,-1.225; 7 -1.075,-1.225; 8 -0.645,-1.225; 9 -0.215,-1.225; 10 0.215,-1.225; 11 0.645,-1.225; 12 1.075,-1.225; 13 1.505,-1.225; 18 1.505,1.225; 19 1.075,1.225; 20 0.645,1.225; 21 0.215,1.225; 22 -0.215,1.225; 23 -0.645,1.225; 24 -1.075,1.225 | smd 0.45 x 0.27: 2 -1.475,0.645; 3 -1.475,0.215; 4 -1.475,-0.215; 5 -1.475,-0.645; 14 1.475,-0.645; 15 1.475,-0.215; 16 1.475,0.215; 17 1.475,0.645
COAXIAL_SMD = smd 1.73 x 1.73: 1 0,0 | smd 2.35 x 1.9: 2@1 -2.375,2.6; 2@2 -2.375,-2.6; 2@3 2.375,-2.6; 2@4 2.375,2.6 | smd 1.5 x 3.4: 2@5 -2.8,0; 2@6 2.8,0
TSX-3225 = smd 1.4 x 1.15: 1 -1.1,-0.8; 2 1.1,-0.8; 3 1.1,0.8; 4 -1.1,0.8
FC-135 = smd 1.003 x 1.803: 1 -1.251,0; 2 1.251,0

### Placement (x,y rotation side)
ANT  2.34,33.83 0 top
C1  7.11,24.26 90 top
C2  7.87,28.57 270 top
C3  18.44,20.73 0 top
C4  9.02,27.43 90 top
C5  9.63,16.41 270 top
C6  10.69,16.41 270 top
C7  4.52,22.86 180 top
C8  7.24,16.51 270 top
C9  18.06,22.38 0 top
C10  16.54,25.17 90 top
C11  18.44,6.6 270 top
C12  18.44,4.09 90 top
C13  12.93,2.92 270 top
C14  11.2,7.98 90 top
C15  10.06,7.95 90 top
C16  15.1,27.08 0 top
C17  13.94,30.33 180 top
C18  14.53,31.95 90 top
C19  9.91,14.22 90 top
C20  11.05,14.22 90 top
C21  7.62,14.22 90 top
C22  12.19,14.22 90 top
C23  8.76,14.22 90 top
C24  26.7,20.22 90 top
C25  15.09,31.34 180 top
C26  12.32,17.73 180 top
D1  24.87,20.42 270 top
FB1  14.12,13.21 90 top
J1  1.45,13.51 90 top
J2  1.47,10.72 270 top
J3  27.71,12.78 180 top
L1  8.08,18.77 180 top
L2  13.94,26.01 0 top
L3  14.53,28.7 90 top
LED1  18.34,9.58 180 top
R1  16.05,7.49 0 top
R2  6.4,5.21 180 top
R3  6.4,4.06 180 top
R4  6.4,2.92 180 top
R5  6.4,1.78 0 top
R6  20.12,19.84 90 top
R7  15.9,9.45 270 top
R8  19.18,11.81 0 top
R9  16.66,12.47 315 top
R10  20.24,18.01 180 top
R11  18.49,19.1 0 top
R12  14.12,15.8 270 top
SJ1  5,13.51 0 top
SJ2  23.95,18.41 180 top
SJ3  21.44,9.63 90 top
SW1  19.43,15.44 0 top
T1  23.24,20.8 0 top
TP2  28.09,19.58 0 top
TP3  28.09,22.12 0 top
TP4  22.48,7.06 0 top
TP5  25.02,7.06 0 top
TP12  27.13,5.23 90 top
TP13  27.13,1.42 90 top
U1  12.45,22.35 270 top
U2  16.54,4.85 90 top
U3  11.1,4.83 90 top
U4  10.03,10.79 0 top
X1  25.22,31.39 90 top
Y1  19.1,25.25 270 top
Y2  6.35,27.94 270 top

### Tracks (layer width: path | path; a pad name or v marks a point on that pad's centre or on a via)
3V3  (via drill 0.35)
  Top 0.406: v4.88,5.21 R2.2 R3.2 R4.2 | v3.23,5.21 3.23,8.97 J2.1 1.47,13.49 J1.1 SJ1.1 | C15.1 10.15,7.28 U3.5 10.09,6.07 v9.14,6.07 | R10.1 21.24,18.42 v21.82,18.42 v21.82,18.41 SJ2.2 23.19,13.18 21.44,11.43 SJ3.2 | FB1.1 14.1,12.33 v14.1,11.02
  Bottom 0.406: v3.23,5.21 v4.88,5.21 5.6,5.21 7.4,3.41 8.46,3.41 9.14,4.09 v9.14,6.07 v14.09,11.02 v14.1,11.02 14.12,11.02 21.52,18.42 v21.82,18.42
BAT
  Top 0.406: C12.1 18.4,3.55 U2.3 | C12.1 23.44,3.5 25.53,1.42 TP13.1 | C12.1 18.44,2.77 17.68,2.01 15.27,2.01 13.77,3.5 C13.1 12.08,3.5 U3.3 12.05,2.89 11.57,2.41 10.64,2.41 10.13,2.92 10.15,2.94 U3.1
C1
  Top 0.254: U4.24 8.96,13.45 C23.1
CAP
  Top 0.254: C22.1 12.19,13.08 12.05,12.94 10.4,12.94 10.25,12.79 U4.21
DCDC_SW
  Top 0.254: U1.17 10.08,19.88 L1.1
DIO_8
  Top 0.254: U1.21 12.7,19.26 14.93,17.03 14.93,10.32 14.11,9.51 14.11,4.88 15.43,3.55 U2.1
DIO_9
  Top 0.254: U1.22 13.2,19.34 15.35,17.18 15.35,10.57 R7.1
DIO_10
  Top 0.254: U1.23 13.7,19.42 15.76,17.35 15.76,13.37 R9.1
DIO_11
  Top 0.254: U1.24 14.2,19.49 16.22,17.47 16.22,14.19 R8.1
DIO_12
  Top 0.254: U1.25 15.62,20.6 16.13,20.09 16.13,19.38 17.4,18.11 19.56,18.11 R10.2 19.96,17.71 19.96,16.64 20.57,16.03 21.44,16.03 21.51,15.96 SW1.P$2
DIO_13
  Top 0.254: U1.26 16.16,21.1 16.54,20.72 16.54,19.7 17.14,19.1 R11.1
GND  (via drill 0.3, 0.3 pad 0.55, 0.35)
  Top 0.254: 12.05,11.43 12.05,11.05 | 12.05,11.05 12.05,10.54 | 12.05,10.54 12.05,10.17 12.07,10.16 12.05,10.15 U4.14 | 12.05,10.54 12.02,10.58 U4.15 | 12.05,11.05 12.02,11.01 U4.16 | C3.2 19.81,20.73 R6.2 | U4.17 12.05,11.43 | U4.20 10.68,12.52 10.69,12.53 11.1,12.53 | 11.1,12.53 U4.19 | U4.18 11.54,12.43 | 11.54,12.43 11.43,12.53 11.1,12.53 | 11.54,12.43 12.05,11.91 12.05,11.43
  Top 0.406: C10.2 16.54,27.08 C16.2 | C5.2 9.91,15.55 C19.2 | C6.2 11.05,15.47 C20.2 | C21.2 7.24,15.19 C8.2
  other vias: 4.88,1.78 12.7,11.43 8.97,8.43 11.28,23.55 12.07,23.55 12.85,23.55 13.64,23.52 11.25,22.73 12.07,22.73 12.85,22.76 13.64,22.76 11.28,21.97 12.07,21.95 12.88,21.97 13.61,21.97 11.28,21.16 12.04,21.16 12.83,21.18 13.61,21.18 16.54,6.38 22.89,19.81 13.92,1.7 19.41,15.01 16.81,17.09 12.83,8.79 19.1,25.25 16.61,33.5 4.93,8.18 12.93,28.47 15.93,28.47 9.07,25.15 10.85,18.03
  pour Bottom: -2.54,33.78 31.75,33.78 31.75,-2.54 -2.54,-2.54
  pour Top: -1.27,33.78 13.72,33.78 13.72,25.32 15.37,25.32 15.37,33.78 20.65,33.78 20.65,35.89 30.48,35.89 30.48,35.84 30.48,33.78 30.48,-2.54 -1.27,-2.54
IMU_VDD
  Top 0.254: U4.1 8.08,12.02 8,11.94 | 8,11.94 8,11.05 8.04,11.01 U4.3 9,11.01 9.79,10.21 10.27,10.21 10.61,10.55 10.61,11.04 10.27,11.38 10.03,11.38 9.82,11.59 U4.22 9.82,12.95 | C20.1 C19.1 9.82,13.56 9.82,12.95 | 9.82,12.95 9.39,12.52 U4.23 | 8,11.94 7.62,12.32 C21.1
  Top 0.406: SJ1.2 7.49,13.51 C21.1
MOTOR_VDD
  Top 0.254: D1.C 26.29,20.05 C24.1
  Top 0.406: C24.1 28.04,19.64 TP2.TP1 | SJ2.1 24.87,18.57 D1.C
N$1
  Top 0.254: C17.1 C18.1 14.51,31.35 C25.2
  Top 0.876: L3.2 C18.1
N$2
  Top 0.254: C7.1 5.36,22.6 U1.12
N$3
  Top 0.254: ANT.1 14.53,33.24
  Top 0.876: C18.2 14.53,33.24
N$4
  Top 0.254: U1.30 16.43,23.1 16.43,23.11 19.3,23.11 19.9,23.71 Y1.3
N$5
  Top 0.254: Y1.1 18.16,26.35 17.3,25.49 17.3,24.08 16.82,23.6 U1.31
N$6
  Top 0.254: Y2.1 6.39,29.16 C2.1 9.14,29.16 9.75,28.55 9.75,26.73 10.54,25.94 12.12,25.94 12.7,25.36 U1.4
N$7
  Top 0.254: Y2.2 6.51,26.85 C4.1 10.34,25.53 11.95,25.53 12.2,25.29 U1.5
N$8
  Top 0.254: R7.2 16.93,8.87 LED1.P$2
N$9
  Top 0.254: LED1.P$3 19.99,10.52 19.99,11.58 R8.2
N$10
  Top 0.254: R9.2 16.94,11.93 LED1.P$4
N$11
  Top 0.406: LED1.P$1 21.43,8.88 SJ3.1
N$12
  Top 0.254: T1.3 D1.A C24.2 28.02,22.12 TP3.TP1
N$13
  Top 0.254: R11.2 19.96,19.1 R6.1 20.55,19.26 22.32,21.03 T1.1
N$14
  Top 0.876: C25.1 25.17,31.34 X1.1
N$15
  Top 0.203: U1.19 11.7,19.27 12.9,18.06 C26.1
  Top 0.406: R12.1 14.12,16.51 C26.1
N$21
  Top 0.254: R1.1 15.47,6.26 U2.5
N$27
  Top 0.254: C14.1 11.28,7.32 11.79,7.32 12.05,7.05 U3.4
RFN
  Top 0.305: U1.2 13.7,25.37 13.37,25.7 L2.1
RFP
  Top 0.254: C16.1 L3.1
  Top 0.305: U1.1 14.2,25.37 14.53,25.7 L2.2
  Top 0.838: L3.1
  Top 0.851: C16.1
  Top 0.876: L2.2 L3.1
SCL  (via drill 0.35)
  Top 0.254: U1.10 8.78,23.6 7.98,24.41 7.98,25.3 7.52,25.76 5.26,25.76 v4.57,25.07 | v10.03,10.79 9.39,11.44 U4.2 | v7.98,4.06 R3.1
  Bottom 0.254: 8.13,12.19 8.13,19.81 4.57,23.37 v4.57,25.07 | 8.13,12.19 9.53,10.79 v10.03,10.79 | J2.3 1.8,5.97 7.24,5.97 8.13,6.86 | v7.98,4.06 8.13,4.22 8.13,6.86 | 8.13,12.19 8.13,6.86
SDA  (via drill 0.35)
  Top 0.254: U1.15 7.77,21.1 5.89,19.23 v5.89,14.97 v5.9,14.96 | J2.4 2.31,3.1 4.01,4.8 4.01,5.36 4.62,5.97 6.38,5.97 7.16,6.76 | R2.1 7.16,5.39 7.16,6.76 | v5.99,12.24 7.21,11.02 | 7.21,11.02 7.66,10.58 U4.4 | 7.21,11.02 7.16,10.97 7.16,6.76
  Bottom 0.254: v5.9,14.96 5.9,12.34 v5.99,12.24
SDO
  Top 0.254: R5.2 7.93,1.78 8.69,2.54 8.69,3.56 | 8.69,3.56 8.69,4.83 7.75,5.77 7.75,9.53 | 8.69,3.56 8.05,2.92 R4.1 | 7.75,9.53 7.75,9.91 8,10.16 8.01,10.15 U4.5 | U4.6 7.79,9.57 7.75,9.53
TCK
  Top 0.254: J1.3 4.46,21.6 U1.14
TMS
  Top 0.254: U1.13 2.42,22.1 J1.4
V_USB
  Top 0.406: J3.VBUS 24.18,11.48 23.39,10.69 23.39,7.98 TP4.TP1 22.48,7.18 C11.1 17.8,7.18 17.48,6.87 U2.4
VDDR  (via drill 0.35)
  Top 0.305: U1.32 15.49,24.1 15.98,24.59 C10.1
  Top 0.406: v20.07,21.57 17.93,21.57 17.48,22.02 C9.1 17.25,22.6 U1.29 | L1.2 7.24,18.71 C8.1 7.55,17.09 v8.71,15.93 | v15.14,24.79 15.34,24.59 C10.1
  Bottom 0.406: v20.07,21.57 18.3,19.8 | 18.3,19.8 14.43,15.93 v8.71,15.93 | 18.3,19.8 18.3,21.63 v15.14,24.79
VDDS  (via drill 0.35)
  Top 0.254: U1.28 16.48,22.1 C3.1 | U1.11 8.39,23.1 7.82,23.68 C1.1
  Top 0.305: U1.18 11.2,19.38 9.63,17.8 C5.1
  Top 0.406: C3.1 17.86,20.68 v17.12,19.94 | v5.97,23.62 7.06,23.62 C1.1 | FB1.2 R12.2 13.86,15.22 12.16,16.92 10.82,16.92 10.79,16.89 C6.1 C5.1 v8.72,16.99 v8.71,16.99
  Bottom 0.406: v5.97,23.62 8.71,20.88 v8.71,16.99 14.17,16.99 v17.12,19.94

### Text on the board
tNames: HW8.1 | Y1 | M- | M+ | 3V3/M | 3V3/IMU | LED/3V3 | GND | V_USB | - | BATTERY | +
bNames: TMS | TCK | GND | 3V3 | 3V3 | GND | SCL | SDA